# Altium project PI_R3_REV1_PRJ.PrjPcb
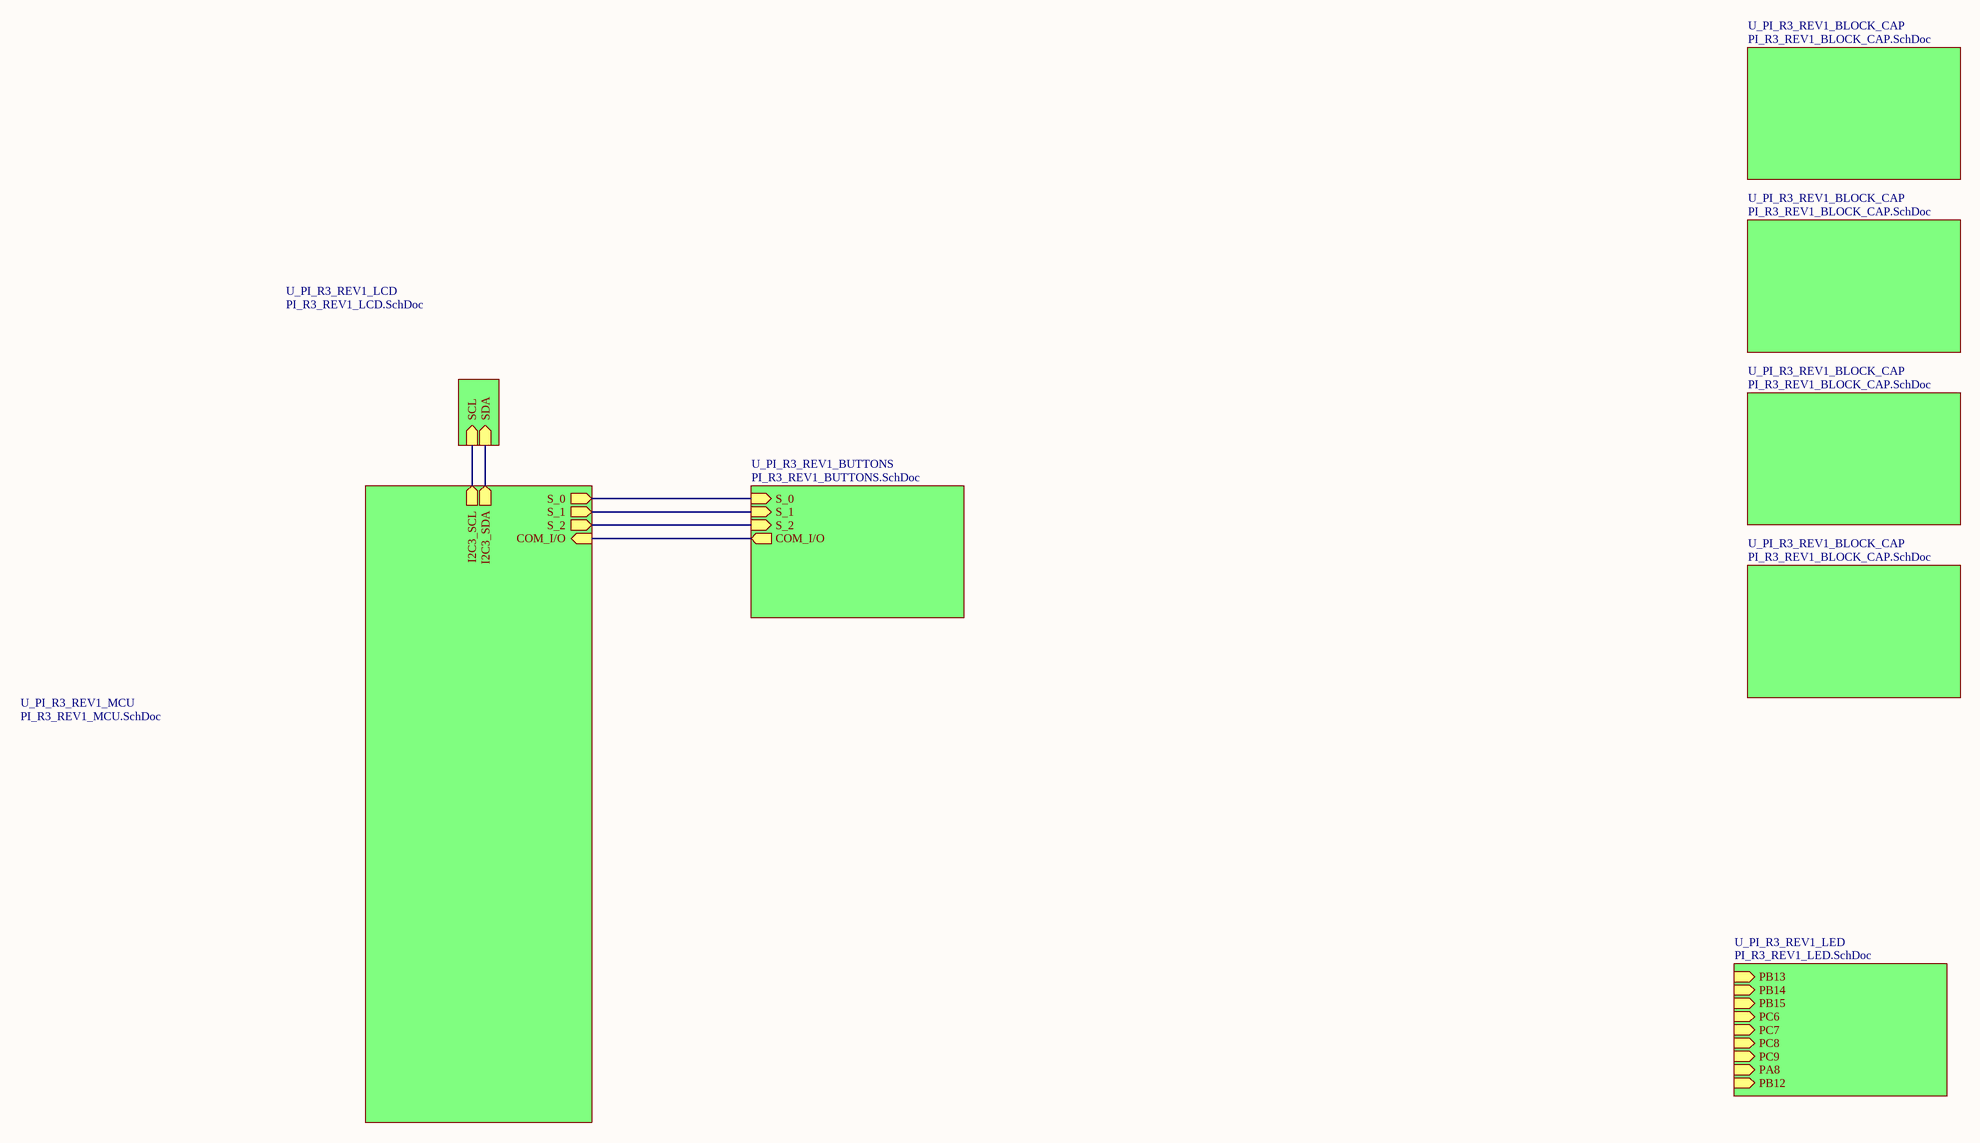
[diagram p0: PI_R3_REV1_MAIN.SchDoc]
6 sheets, 63 parts. Net scope: hierarchical (ports join the sheet entries above them; power ports are global).
Board file: PI_R3_REV1_PCB.PcbDoc
Sheets:
  PI_R3_REV1_MAIN.SchDoc
    U_PI_R3_REV1_MCU = PI_R3_REV1_MCU.SchDoc
    U_PI_R3_REV1_BLOCK_CAP = PI_R3_REV1_BLOCK_CAP.SchDoc
    U_PI_R3_REV1_BLOCK_CAP = PI_R3_REV1_BLOCK_CAP.SchDoc
    U_PI_R3_REV1_BLOCK_CAP = PI_R3_REV1_BLOCK_CAP.SchDoc
    U_PI_R3_REV1_BLOCK_CAP = PI_R3_REV1_BLOCK_CAP.SchDoc
    U_PI_R3_REV1_BUTTONS = PI_R3_REV1_BUTTONS.SchDoc
    U_PI_R3_REV1_LCD = PI_R3_REV1_LCD.SchDoc
    U_PI_R3_REV1_LED = PI_R3_REV1_LED.SchDoc

## Sheet PI_R3_REV1_MAIN.SchDoc
size 500 x 500 mm

### Sub-sheets
U_PI_R3_REV1_BLOCK_CAP = PI_R3_REV1_BLOCK_CAP.SchDoc: no entries
U_PI_R3_REV1_BLOCK_CAP = PI_R3_REV1_BLOCK_CAP.SchDoc: no entries
U_PI_R3_REV1_BLOCK_CAP = PI_R3_REV1_BLOCK_CAP.SchDoc: no entries
U_PI_R3_REV1_BLOCK_CAP = PI_R3_REV1_BLOCK_CAP.SchDoc: no entries
U_PI_R3_REV1_BUTTONS = PI_R3_REV1_BUTTONS.SchDoc: S_1 (in), S_2 (in), S_0 (in), COM_I/O (out)
U_PI_R3_REV1_LCD = PI_R3_REV1_LCD.SchDoc: SCL (in), SDA (in)
U_PI_R3_REV1_LED = PI_R3_REV1_LED.SchDoc: PB13 (in), PB14 (in), PB15 (in), PC6 (in), PC7 (in), PC8 (in), PC9 (in), PA8 (in), PB12 (in)
U_PI_R3_REV1_MCU = PI_R3_REV1_MCU.SchDoc: COM_I/O (in), S_1 (out), S_0 (out), S_2 (out), I2C3_SCL (out), I2C3_SDA (out)

### Nets
NetU1_14: sheet U_PI_R3_REV1_MCU/I2C3_SCL, sheet U_PI_R3_REV1_LCD/SCL
NetU1_15: sheet U_PI_R3_REV1_MCU/I2C3_SDA, sheet U_PI_R3_REV1_LCD/SDA
NetU2_24: sheet U_PI_R3_REV1_MCU/S_2, sheet U_PI_R3_REV1_BUTTONS/S_2
NetU2_25: sheet U_PI_R3_REV1_MCU/S_1, sheet U_PI_R3_REV1_BUTTONS/S_1
NetU2_26: sheet U_PI_R3_REV1_MCU/S_0, sheet U_PI_R3_REV1_BUTTONS/S_0
NetU2_27: sheet U_PI_R3_REV1_MCU/COM_I/O, sheet U_PI_R3_REV1_BUTTONS/COM_I/O

## Sheet PI_R3_REV1_MCU.SchDoc
size 500 x 500 mm
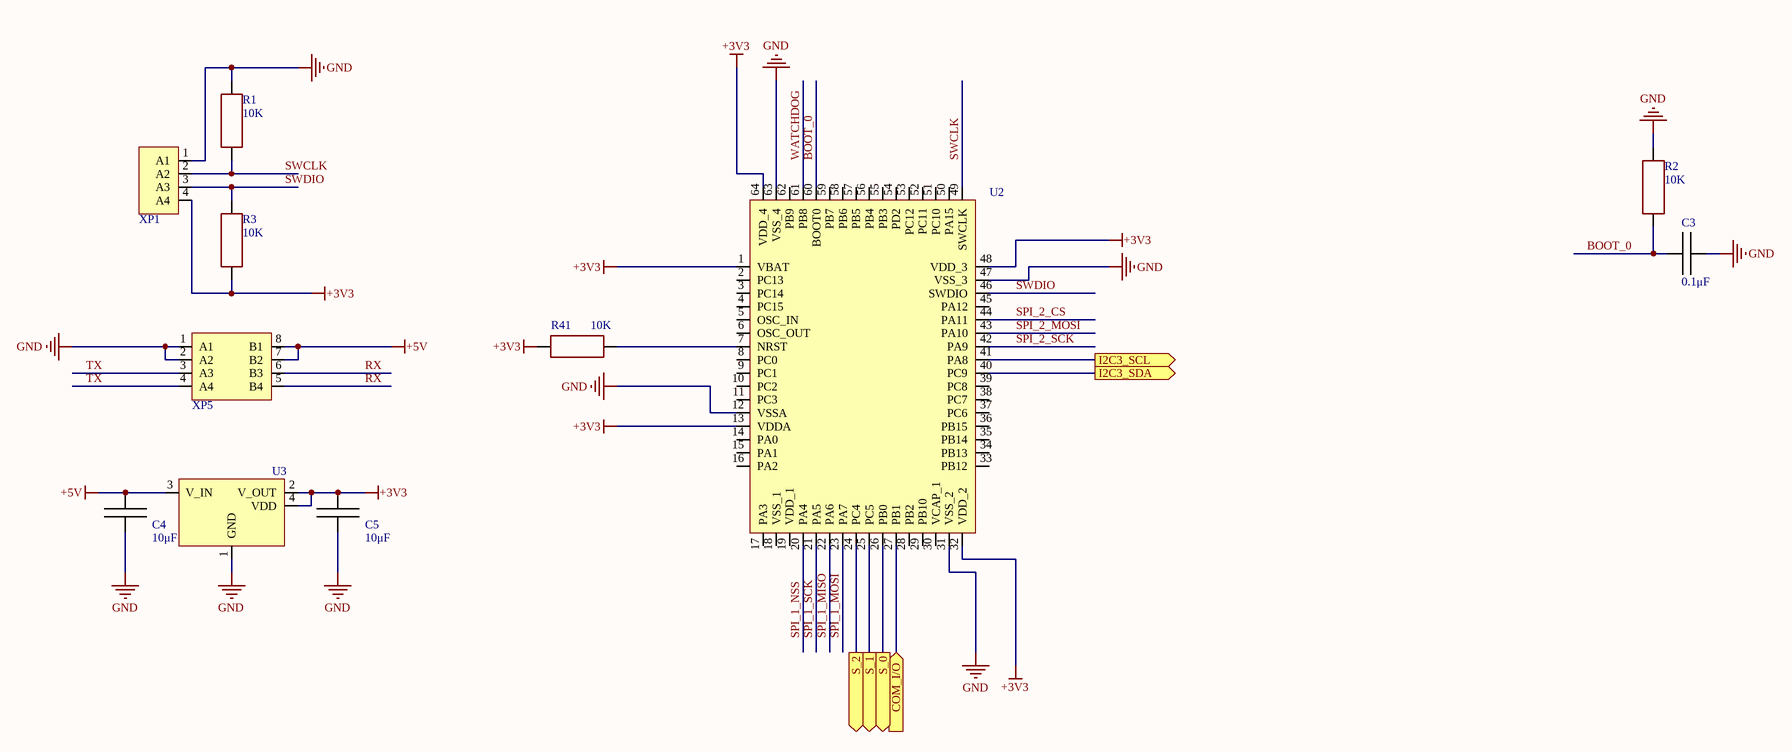
[diagram p1: PI_R3_REV1_MCU.SchDoc]

### Parts
C3  value 0.1μF  [CAP: 0402]  (hidden comment: Cap_0402)
C4  value 10μF  [CAP: 0805]  (hidden comment: Cap_0805)
C5  value 10μF  [CAP: 0805]  (hidden comment: Cap_0805)
R1  value 10K  [RES: 0402]
R2  value 10K  [RES: 0402]
R3  value 10K  [RES: 0402]
R41  value 10K  [RES: 0402]
U2  STM32F413RGT6  [LQFP-64]  (value not drawn)
U3  LD1117S33CTR4  [SOT-223-3]  (value not drawn)
XP1  PLS-6 (DS1021-1x6)  [PLS-4 (DS1021-1x4)]  (value not drawn)
XP5  55508-008TRLF  [55508-008TRLF]  (value not drawn)

### Ports
COM_I/O (in), I2C3_SCL (out), I2C3_SDA (out), S_0 (out), S_1 (out), S_2 (out)

### Nets
+3V3: C5.2 R3.1 R41.1 U2.1(VBAT) U2.13(VDDA) U2.32(VDD_2) U2.48(VDD_3) U2.64(VDD_4) U3.2(V_OUT) U3.4(VDD) XP1.4(A4)
+5V: C4.2 U3.3(V_IN) XP5.7(B2) XP5.8(B1)
GND: C3.1 C4.1 C5.1 R1.2 R2.1 U2.12(VSSA) U2.31(VSS_2) U2.47(VSS_3) U2.63(VSS_4) U3.1(GND) XP1.1(A1) XP5.1(A1) XP5.2(A2)
BOOT_0: C3.2 R2.2 U2.60(BOOT0)
RX: XP5.5(B4) XP5.6(B3)
SPI_1_MISO: U2.22(PA6)
SPI_1_MOSI: U2.23(PA7)
SPI_1_NSS: U2.20(PA4)
SPI_1_SCK: U2.21(PA5)
SPI_2_CS: U2.44(PA11)
SPI_2_MOSI: U2.43(PA10)
SPI_2_SCK: U2.42(PA9)
SWCLK: R1.1 U2.49(SWCLK) XP1.2(A2)
SWDIO: R3.2 U2.46(SWDIO) XP1.3(A3)
TX: XP5.3(A3) XP5.4(A4)
WATCHDOG: U2.61(PB8)
NetR41_2: R41.2 U2.7(NRST)
NetU1_14: U2.41(PA8) ; port I2C3_SCL
NetU1_15: U2.40(PC9) ; port I2C3_SDA
NetU2_24: U2.24(PC4) ; port S_2
NetU2_25: U2.25(PC5) ; port S_1
NetU2_26: U2.26(PB0) ; port S_0
NetU2_27: U2.27(PB1) ; port COM_I/O

Not connected (* = marked no-connect by the designer): U2 2(PC13) 3(PC14) 4(PC15) 5(OSC_IN) 6(OSC_OUT) 8(PC0) 9(PC1) 10(PC2) 11(PC3) 14(PA0) 15(PA1) 16(PA2) 17(PA3) 18(VSS_1) 19(VDD_1) 28(PB2) 29(PB10) 30(VCAP_1) 33(PB12) 34(PB13) 35(PB14) 36(PB15) 37(PC6) 38(PC7) 39(PC8) 45(PA12) 50(PA15) 51(PC10) 52(PC11) 53(PC12) 54(PD2) 55(PB3) 56(PB4) 57(PB5) 58(PB6) 59(PB7) 62(PB9)

### Library data of the parts
C3 = Cap_0402: TypeDielectric: X7R(X5R); Voltage: ??V; Package/Case: 0402; Temperature: -55...+125°C(-55...+85°C); Product Category: Capacitors
C4 C5 = Cap_0805: TypeDielectric: X7R(X5R); Voltage: ??V; Package/Case: 0805; Temperature: -55...+125°C(-55...+85°C); Product Category: Capacitors
R1-R3 R41 = Resistor_0402: Tolerance: ±5%; Product Category: Resistors; Package/Case: 0402; Temperature: -55...+125°C
U2 = STM32F413RGT6: ARM Microcontrollers - MCU High-performance access line, Arm Cortex-M4 core DSP & FPU, 1 MByte of Flash 100; Manufacturer: STMicroelectronics; Datasheet: https://eu.mouser.com/datasheet/2/389/stm32f413cg-1851205.pdf; HelpURL: https://eu.mouser.com/ProductDetail/STMicroelectronics/STM32F413RGT6?qs=FNcb6ahWXRyREY%252BFzgYY7A%3D%3D; Package/Case: LQFP-64; Product Category: Microcontrollers
U3 = LD1117S33CTR: LDO Voltage Regulator 3.3V 0.8A Positive; Manufacturer: STMicroelectronics; Datasheet: https://eu.mouser.com/datasheet/2/389/cd00000544-1795431.pdf; HelpURL: https://eu.mouser.com/ProductDetail/STMicroelectronics/LD1117S33CTR?qs=8u%2FLf1IQwKF9meFZLHfRog%3D%3D; Package/Case: SOT-223-3; Product Category: Voltage Regulators
XP1 = PLS-4 (DS1021-1x4): Board to Board, Surface Mount, Single row, 6 Positions, 2.54mm, Vertical.; Manufacturer: Connfly; Datasheet: https://static.chipdip.ru/lib/977/DOC005977245.pdf; HelpURL: https://www.chipdip.by/product/pls-4; Product Category: Connectors
XP5 = 55508-008TRLF: Board to Board, Receptacle, Surface Mount, Double row, 8 Positions, 2mm (0.079inch), Vertical.; Manufacturer: Amphenol FCI; Datasheet: https://cdn.amphenol-cs.com/media/wysiwyg/files/documentation/datasheet/boardwiretoboard/bwb_minitek2mm_receptacle.pdf; HelpURL: https://eu.mouser.com/ProductDetail/Amphenol-FCI/55508-008TRLF?qs=u4%252BeTlRBLCQJeJ23kDZ66A%3D%3D; Product Category: Connectors

## Sheet PI_R3_REV1_BLOCK_CAP.SchDoc
size 100 x 100 mm
Used 4 times, as channels U_PI_R3_REV1_BLOCK_CAP, U_PI_R3_REV1_BLOCK_CAP, U_PI_R3_REV1_BLOCK_CAP, U_PI_R3_REV1_BLOCK_CAP. Parts and nets are listed once, with the designators drawn on the sheet.
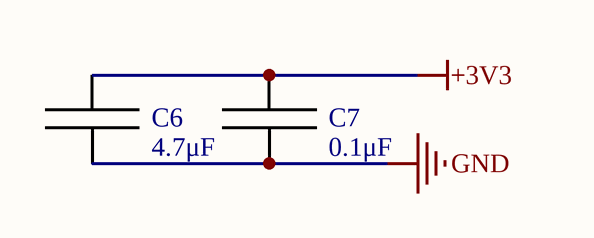
[diagram p2: PI_R3_REV1_BLOCK_CAP.SchDoc]

### Parts
C6  value 4.7μF  [CAP: 0402]  (hidden comment: Cap_0402)
C7  value 0.1μF  [CAP: 0402]  (hidden comment: Cap_0402)

### Nets
+3V3: C6.2 C7.2
GND: C6.1 C7.1

### Channels
U_PI_R3_REV1_BLOCK_CAP: designators end in _U_PI_R3_REV1_BLOCK_CAP#1
U_PI_R3_REV1_BLOCK_CAP: designators end in _U_PI_R3_REV1_BLOCK_CAP#2
U_PI_R3_REV1_BLOCK_CAP: designators end in _U_PI_R3_REV1_BLOCK_CAP#3
U_PI_R3_REV1_BLOCK_CAP: designators end in _U_PI_R3_REV1_BLOCK_CAP#4

### Library data of the parts
C6 C7 = Cap_0402: TypeDielectric: X7R(X5R); Voltage: ??V; Package/Case: 0402; Temperature: -55...+125°C(-55...+85°C); Product Category: Capacitors

## Sheet PI_R3_REV1_BUTTONS.SchDoc
size 299 x 299 mm
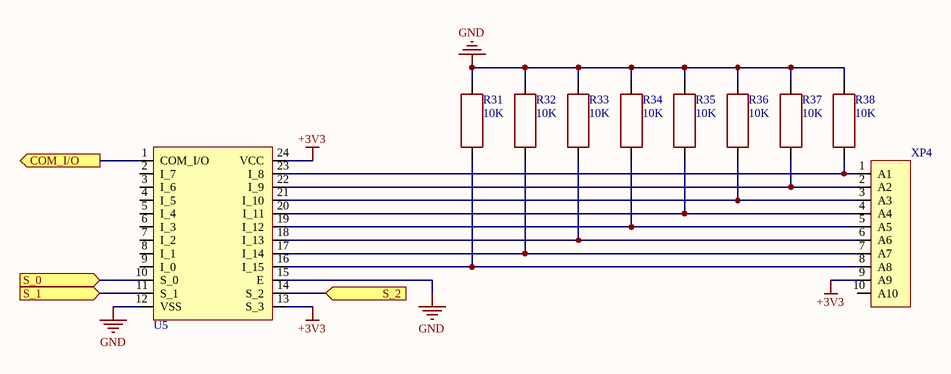
[diagram p3: PI_R3_REV1_BUTTONS.SchDoc]

### Parts
R31  value 10K  [RES: 0402]
R32  value 10K  [RES: 0402]
R33  value 10K  [RES: 0402]
R34  value 10K  [RES: 0402]
R35  value 10K  [RES: 0402]
R36  value 10K  [RES: 0402]
R37  value 10K  [RES: 0402]
R38  value 10K  [RES: 0402]
U5  CD74HC4067M96  [SOIC-24]  (value not drawn)
XP4  10FDZ-BT  [10FDZ-BT]  (value not drawn)

### Ports
COM_I/O (out), S_0 (in), S_1 (in), S_2 (in)

### Nets
+3V3: U5.13(S_3) U5.24(VCC) XP4.9(A9)
GND: R31.1 R32.1 R33.1 R34.1 R35.1 R36.1 R37.1 R38.1 U5.12(VSS) U5.15(E)
NetR31_2: R31.2 U5.16(I_15) XP4.8(A8)
NetR32_2: R32.2 U5.17(I_14) XP4.7(A7)
NetR33_2: R33.2 U5.18(I_13) XP4.6(A6)
NetR34_2: R34.2 U5.19(I_12) XP4.5(A5)
NetR35_2: R35.2 U5.20(I_11) XP4.4(A4)
NetR36_2: R36.2 U5.21(I_10) XP4.3(A3)
NetR37_2: R37.2 U5.22(I_9) XP4.2(A2)
NetR38_2: R38.2 U5.23(I_8) XP4.1(A1)
NetU2_24: U5.14(S_2) ; port S_2
NetU2_25: U5.11(S_1) ; port S_1
NetU2_26: U5.10(S_0) ; port S_0
NetU2_27: U5.1(COM_I/O) ; port COM_I/O

Not connected (* = marked no-connect by the designer): U5 2(I_7) 3(I_6) 4(I_5) 5(I_4) 6(I_3) 7(I_2) 8(I_1) 9(I_0); XP4 10(A10)

### Library data of the parts
R31-R38 = Resistor_0402: Tolerance: ±5%; Product Category: Resistors; Package/Case: 0402; Temperature: -55...+125°C
U5 = CD74HC4067M96: 1 MHz, Low-Power Op Amp; Manufacturer: Texas Instruments; Datasheet: https://www.ti.com/general/docs/suppproductinfo.tsp?distId=26&gotoUrl=https://www.ti.com/lit/gpn/cd74hct4067; HelpURL: https://eu.mouser.com/ProductDetail/Texas-Instruments/CD74HC4067M96?qs=xFfolx0DHx0XT7d9xTTZBA%3D%3D; Package/Case: SOIC-24; Product Category: Multiplexers
XP4 = 10FDZ-BT: The FDZ connector, a Zero Insertion Force / (ZIF) connector, was developed to connect / FPC and membrane switch leads. This / combination of features allows greater / freedom in internal wiring designs. No / force is required to insert the leads. Once / inserted, the leads are securely held and / locked by moving the slide. The contact is / double-sided to ensure greater reliability.; Manufacturer: JST; Datasheet: https://static.chipdip.ru/lib/060/DOC000060454.pdf; HelpURL: https://www.chipdip.ru/product/10fdz-bt; Product Category: Connectors

## Sheet PI_R3_REV1_LCD.SchDoc
size 500 x 500 mm
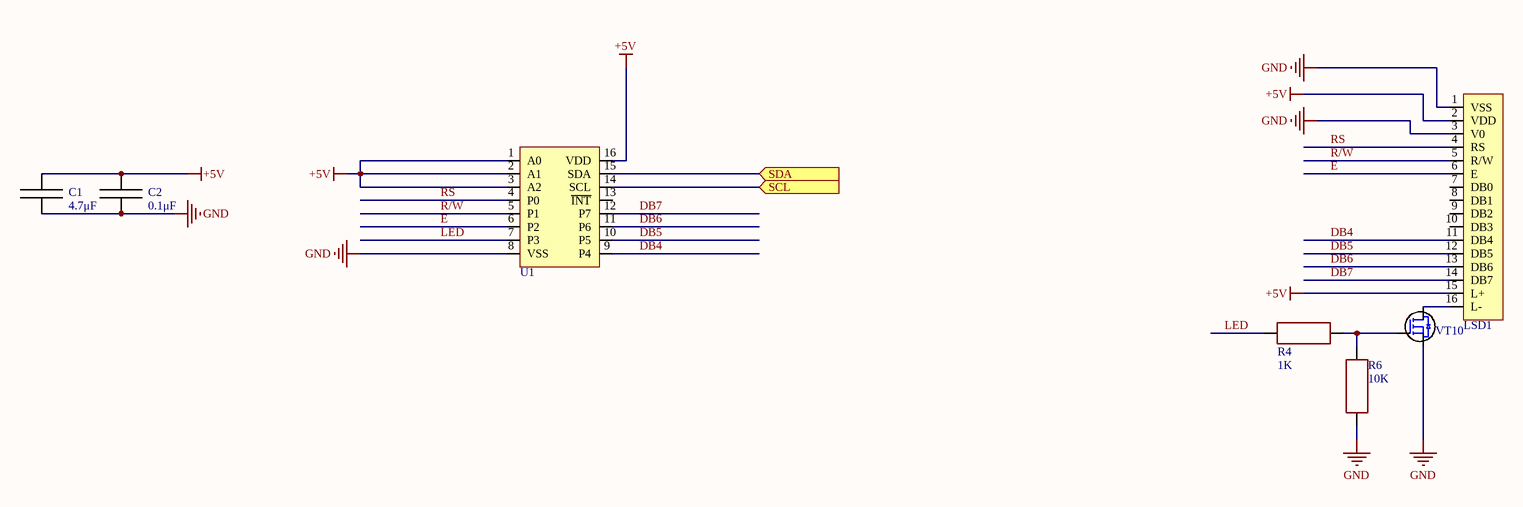
[diagram p4: PI_R3_REV1_LCD.SchDoc]

### Parts
C1  value 4.7μF  [CAP: 0402]  (hidden comment: Cap_0402)
C2  value 0.1μF  [CAP: 0402]  (hidden comment: Cap_0402)
LSD1  WH2004A  [WH2004A]  (value not drawn)
R4  value 1K  [RES: 0402]
R6  value 10K  [RES: 0402]
U1  PCF8574  [SOIC-16]  (value not drawn)
VT10  2N7002(NX7002AK)  [SOT-23-3]  (value not drawn)

### Ports
SCL (in), SDA (in)

### Nets
+5V: C1.2 C2.2 LSD1.2(VDD) LSD1.15(L+) U1.1(A0) U1.2(A1) U1.3(A2) U1.16(VDD)
GND: C1.1 C2.1 LSD1.1(VSS) LSD1.3(V0) R6.2 U1.8(VSS) VT10.3
DB4: LSD1.11(DB4) U1.9(P4)
DB5: LSD1.12(DB5) U1.10(P5)
DB6: LSD1.13(DB6) U1.11(P6)
DB7: LSD1.14(DB7) U1.12(P7)
E: LSD1.6(E) U1.6(P2)
LED: R4.1 U1.7(P3)
R/W: LSD1.5(R/W) U1.5(P1)
RS: LSD1.4(RS) U1.4(P0)
NetLSD1_16: LSD1.16(L-) VT10.2
NetR4_2: R4.2 R6.1 VT10.1
NetU1_14: U1.14(SCL) ; port SCL
NetU1_15: U1.15(SDA) ; port SDA

Not connected (* = marked no-connect by the designer): LSD1 7(DB0) 8(DB1) 9(DB2) 10(DB3); U1 13(~{INT})

### Library data of the parts
C1 C2 = Cap_0402: TypeDielectric: X7R(X5R); Voltage: ??V; Package/Case: 0402; Temperature: -55...+125°C(-55...+85°C); Product Category: Capacitors
LSD1 = WH2004A: LCD Character Display  20x4; Manufacturer: Winstar; Datasheet: https://www.winstar.com.tw/uploads/files/e97d4fb1a675762f600be546831f7c7f.pdf; HelpURL: https://www.winstar.com.tw/ru/products/character-lcd-display-module/wh2004a.html; Product Category: LCD
R4 R6 = Resistor_0402: Tolerance: ±5%; Product Category: Resistors; Package/Case: 0402; Temperature: -55...+125°C
U1 = PCF8574: 1 MHz, Low-Power Op Amp; Manufacturer: NXP; Datasheet: https://eu.mouser.com/datasheet/2/302/PCF8574_PCF8574A-1127673.pdf; HelpURL: https://eu.mouser.com/ProductDetail/NXP-Semiconductors/PCF8574T-3518?qs=LOCUfHb8d9srwcgHHpXqQw%3D%3D; Package/Case: SOIC-16; Product Category: I/O Expanders
VT10 = 2N7002: MOSFET N-CHANNEL 60V 115mA; Manufacturer: Fairchild; Datasheet: https://eu.mouser.com/datasheet/2/308/NDS7002A_D-1522662.pdf; HelpURL: https://eu.mouser.com/ProductDetail/onsemi-Fairchild/2N7002?qs=0dwsXDNhqlz66WJJhrTFjQ%3D%3D; Package/Case: SOT-23; Product Category: MOSFET; Analogue: NX7002AK

## Sheet PI_R3_REV1_LED.SchDoc
size 500 x 500 mm
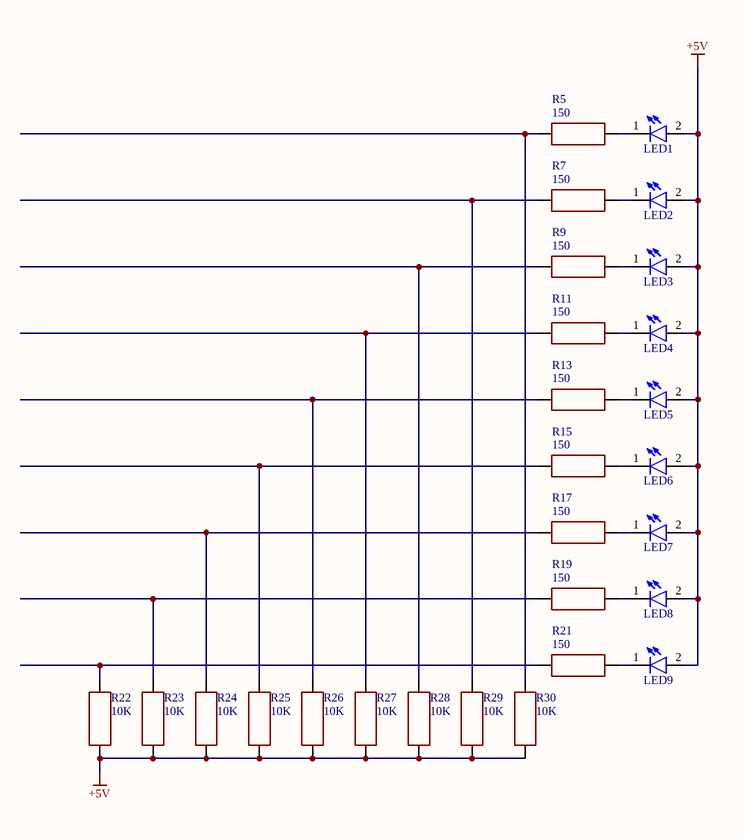
[diagram p5: PI_R3_REV1_LED.SchDoc]

### Parts
LED1  L1043  [L1043]  (value not drawn)
LED2  L1043  [L1043]  (value not drawn)
LED3  L1043  [L1043]  (value not drawn)
LED4  L1043  [L1043]  (value not drawn)
LED5  L1043  [L1043]  (value not drawn)
LED6  L1043  [L1043]  (value not drawn)
LED7  L1043  [L1043]  (value not drawn)
LED8  L1043  [L1043]  (value not drawn)
LED9  L1043  [L1043]  (value not drawn)
R5  value 150  [RES: 0402]
R7  value 150  [RES: 0402]
R9  value 150  [RES: 0402]
R11  value 150  [RES: 0402]
R13  value 150  [RES: 0402]
R15  value 150  [RES: 0402]
R17  value 150  [RES: 0402]
R19  value 150  [RES: 0402]
R21  value 150  [RES: 0402]
R22  value 10K  [RES: 0402]
R23  value 10K  [RES: 0402]
R24  value 10K  [RES: 0402]
R25  value 10K  [RES: 0402]
R26  value 10K  [RES: 0402]
R27  value 10K  [RES: 0402]
R28  value 10K  [RES: 0402]
R29  value 10K  [RES: 0402]
R30  value 10K  [RES: 0402]

### Nets
+5V: LED1.2 LED2.2 LED3.2 LED4.2 LED5.2 LED6.2 LED7.2 LED8.2 LED9.2 R22.2 R23.2 R24.2 R25.2 R26.2 R27.2 R28.2 R29.2 R30.2
NetLED1_1: LED1.1 R5.2
NetLED2_1: LED2.1 R7.2
NetLED3_1: LED3.1 R9.2
NetLED4_1: LED4.1 R11.2
NetLED5_1: LED5.1 R13.2
NetLED6_1: LED6.1 R15.2
NetLED7_1: LED7.1 R17.2
NetLED8_1: LED8.1 R19.2
NetLED9_1: LED9.1 R21.2
NetR5_1: R5.1 R30.1
NetR7_1: R7.1 R29.1
NetR9_1: R9.1 R28.1
NetR11_1: R11.1 R27.1
NetR13_1: R13.1 R26.1
NetR15_1: R15.1 R25.1
NetR17_1: R17.1 R24.1
NetR19_1: R19.1 R23.1
NetR21_1: R21.1 R22.1

### Library data of the parts
LED1-LED9 = L1043: Manufacturer: Kingbright; Datasheet: https://eu.mouser.com/datasheet/2/216/wp1043srd-1173495.pdf; HelpURL: https://eu.mouser.com/ProductDetail/Kingbright/L1043SRD?qs=fKJLI%2FsxXOeuHTGKDg%2F2bg%3D%3D; Product Category: LED Bars and Arrays
R5 R7 R9 R11 R13 R15 R17 R19 R21-R30 = Resistor_0402: Tolerance: ±5%; Product Category: Resistors; Package/Case: 0402; Temperature: -55...+125°C

## Nets that join several sheets
+3V3: PI_R3_REV1_MCU (11 pins), U_PI_R3_REV1_BLOCK_CAP (C6_U_PI_R3_REV1_BLOCK_CAP#1.2 C7_U_PI_R3_REV1_BLOCK_CAP#1.2), U_PI_R3_REV1_BLOCK_CAP (C6_U_PI_R3_REV1_BLOCK_CAP#2.2 C7_U_PI_R3_REV1_BLOCK_CAP#2.2), U_PI_R3_REV1_BLOCK_CAP (C6_U_PI_R3_REV1_BLOCK_CAP#3.2 C7_U_PI_R3_REV1_BLOCK_CAP#3.2), U_PI_R3_REV1_BLOCK_CAP (C6_U_PI_R3_REV1_BLOCK_CAP#4.2 C7_U_PI_R3_REV1_BLOCK_CAP#4.2), PI_R3_REV1_BUTTONS (U5.13 U5.24 XP4.9)
+5V: PI_R3_REV1_MCU (C4.2 U3.3 XP5.7 XP5.8), PI_R3_REV1_LCD (8 pins), PI_R3_REV1_LED (18 pins)
GND: PI_R3_REV1_MCU (13 pins), U_PI_R3_REV1_BLOCK_CAP (C6_U_PI_R3_REV1_BLOCK_CAP#1.1 C7_U_PI_R3_REV1_BLOCK_CAP#1.1), U_PI_R3_REV1_BLOCK_CAP (C6_U_PI_R3_REV1_BLOCK_CAP#2.1 C7_U_PI_R3_REV1_BLOCK_CAP#2.1), U_PI_R3_REV1_BLOCK_CAP (C6_U_PI_R3_REV1_BLOCK_CAP#3.1 C7_U_PI_R3_REV1_BLOCK_CAP#3.1), U_PI_R3_REV1_BLOCK_CAP (C6_U_PI_R3_REV1_BLOCK_CAP#4.1 C7_U_PI_R3_REV1_BLOCK_CAP#4.1), PI_R3_REV1_BUTTONS (10 pins), PI_R3_REV1_LCD (7 pins)
NetU1_14: PI_R3_REV1_MCU (U2.41), PI_R3_REV1_LCD (U1.14)
NetU1_15: PI_R3_REV1_MCU (U2.40), PI_R3_REV1_LCD (U1.15)
NetU2_24: PI_R3_REV1_MCU (U2.24), PI_R3_REV1_BUTTONS (U5.14)
NetU2_25: PI_R3_REV1_MCU (U2.25), PI_R3_REV1_BUTTONS (U5.11)
NetU2_26: PI_R3_REV1_MCU (U2.26), PI_R3_REV1_BUTTONS (U5.10)
NetU2_27: PI_R3_REV1_MCU (U2.27), PI_R3_REV1_BUTTONS (U5.1)